# Altium schematic sheet Bussiness-card_Linux.SchDoc
size 292 x 193 mm; Author: Power Lin; SheetNumber: 1; SheetTotal: 1; Website: wiki-power.com
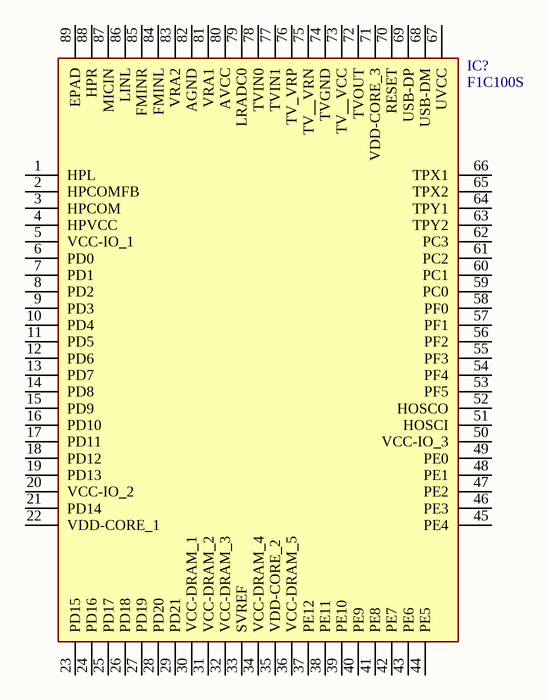
[diagram p0: Bussiness-card_Linux.SchDoc]

## Parts
IC?  F1C100S  [QFN88P_10X10mm]

## Nets

Not connected (* = marked no-connect by the designer): IC? 1(HPL) 2(HPCOMFB) 3(HPCOM) 4(HPVCC) 5(VCC-IO_1) 6(PD0) 7(PD1) 8(PD2) 9(PD3) 10(PD4) 11(PD5) 12(PD6) 13(PD7) 14(PD8) 15(PD9) 16(PD10) 17(PD11) 18(PD12) 19(PD13) 20(VCC-IO_2) 21(PD14) 22(VDD-CORE_1) 23(PD15) 24(PD16) 25(PD17) 26(PD18) 27(PD19) 28(PD20) 29(PD21) 30(VCC-DRAM_1) 31(VCC-DRAM_2) 32(VCC-DRAM_3) 33(SVREF) 34(VCC-DRAM_4) 35(VDD-CORE_2) 36(VCC-DRAM_5) 37(PE12) 38(PE11) 39(PE10) 40(PE9) 41(PE8) 42(PE7) 43(PE6) 44(PE5) 45(PE4) 46(PE3) 47(PE2) 48(PE1) 49(PE0) 50(VCC-IO_3) 51(HOSCI) 52(HOSCO) 53(PF5) 54(PF4) 55(PF3) 56(PF2) 57(PF1) 58(PF0) 59(PC0) 60(PC1) 61(PC2) 62(PC3) 63(TPY2) 64(TPY1) 65(TPX2) 66(TPX1) 67(UVCC) 68(USB-DM) 69(USB-DP) 70(RESET) 71(VDD-CORE_3) 72(TVOUT) 73(TV__VCC) 74(TVGND) 75(TV__VRN) 76(TV_VRP) 77(TVIN1) 78(TVIN0) 79(LRADC0) 80(AVCC) 81(VRA1) 82(AGND) 83(VRA2) 84(FMINL) 85(FMINR) 86(LINL) 87(MICIN) 88(HPR) 89(EPAD)

## Notes on the sheet
- Author
- DocumentName
- ModifiedDate
- ProjectName
- SheetNumber
- SheetTotal
- Website
- Revision

## Library data of the parts
IC? = F1C100S: CPU 处理器; Manufacturer_Name: Allwinner Technology; Description: F1C100s Processor; Datasheet Link: https://linux-sunxi.org/images/b/ba/F1C100s_Datasheet_V1.0.pdf; Height: 0.9mm; Manufacturer_Part_Number: F1C100S